# EAGLE schematic touch_pot_v13 (EAGLE 7.2.0)
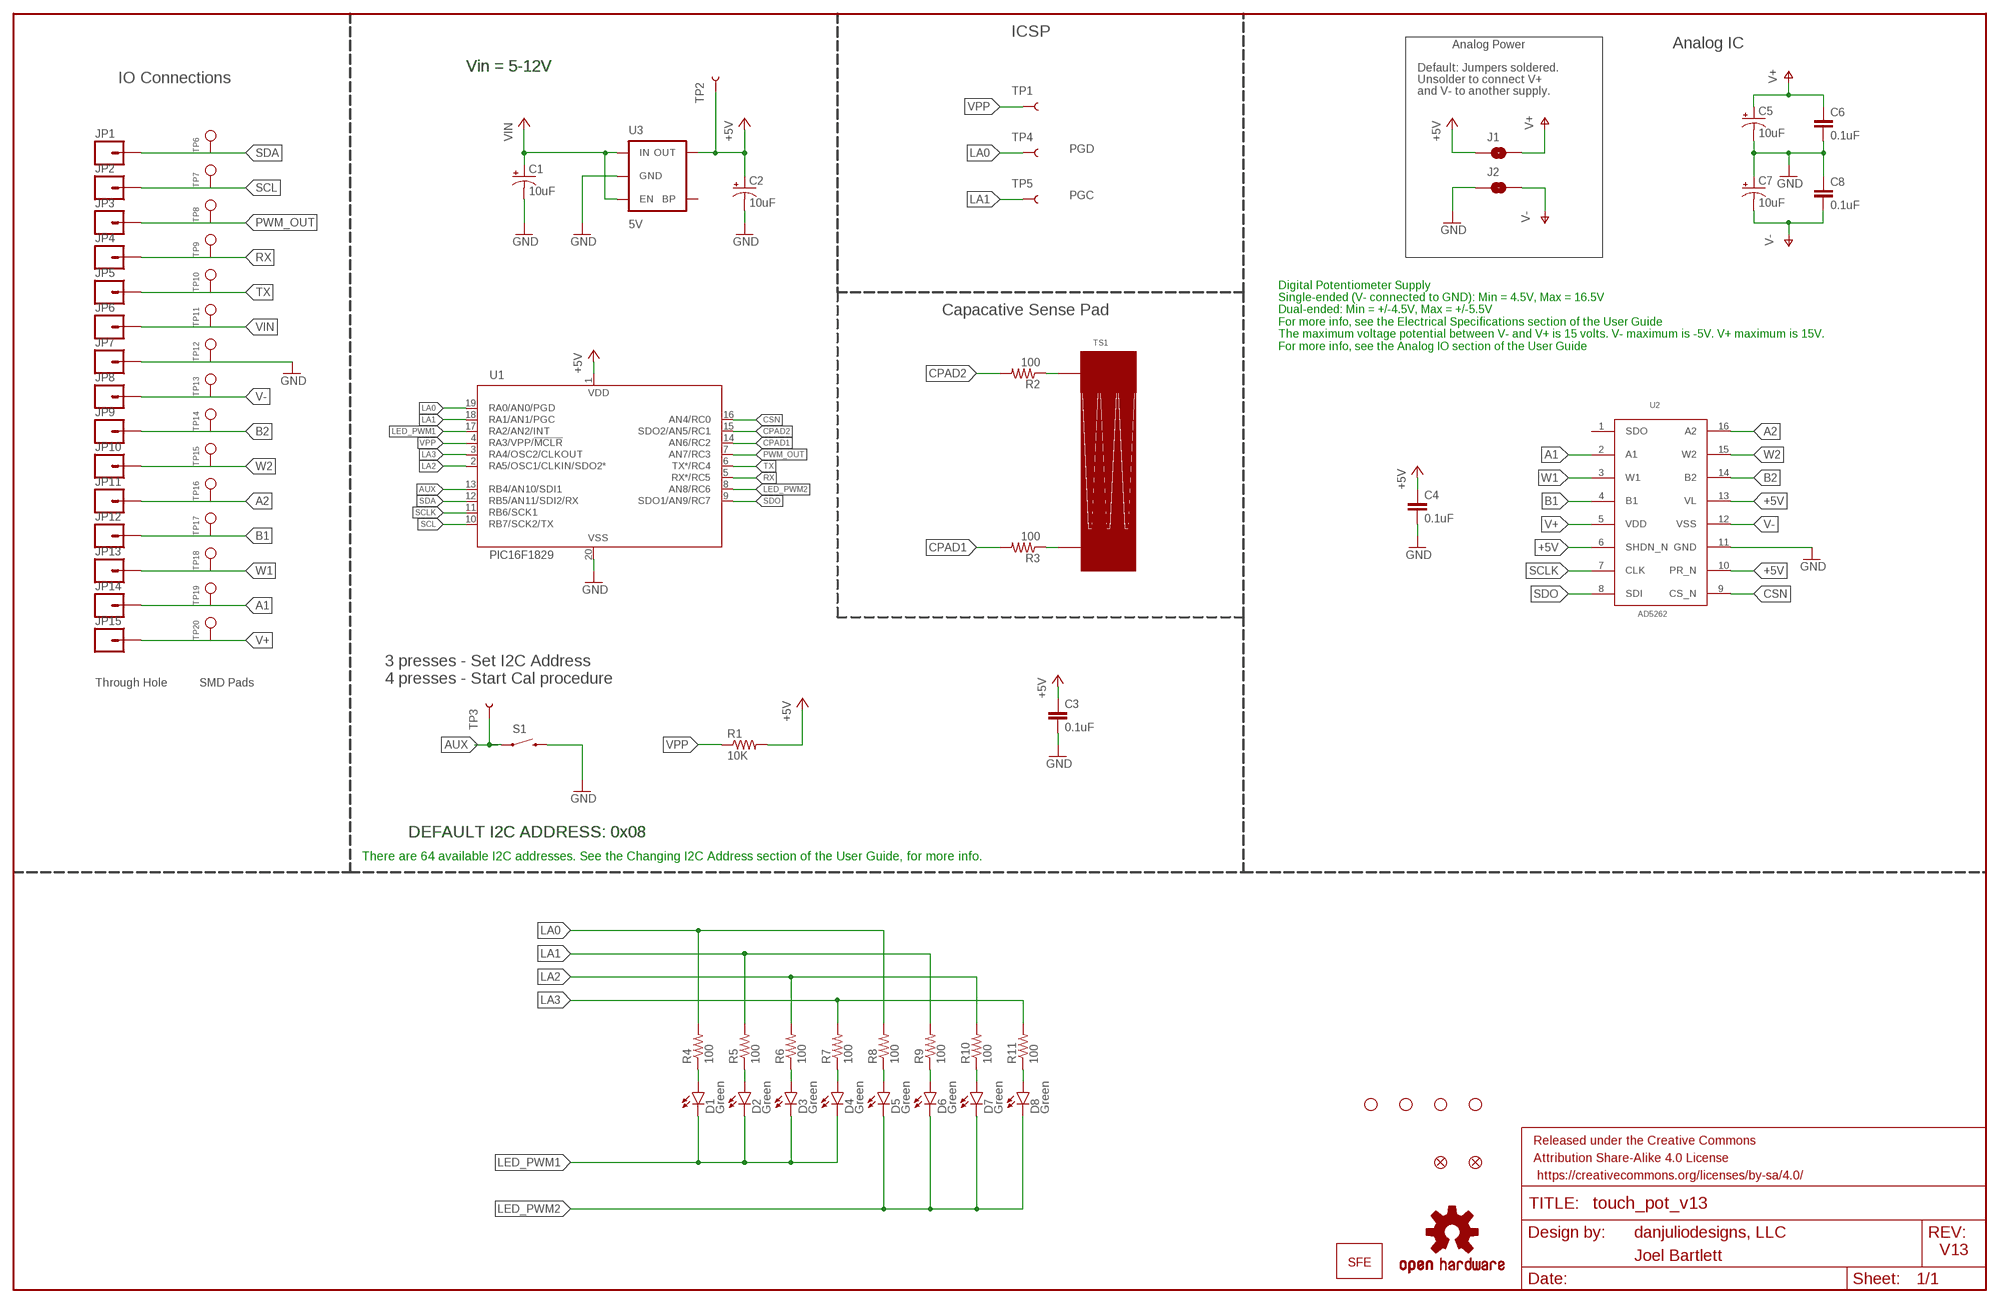
[diagram p0: schematic, sheet 1]

## Parts
C1  10uF  10UF-16V-10%(TANT)  [EIA3216]
C2  10uF  10UF-16V-10%(TANT)  [EIA3216]
C3  0.1uF  0.1UF-25V(+80/-20%)(0603)  [0603-CAP]
C4  0.1uF  0.1UF-25V(+80/-20%)(0603)  [0603-CAP]
C5  10uF  10UF-16V-10%(TANT)  [EIA3216]
C6  0.1uF  0.1UF-25V(+80/-20%)(0603)  [0603-CAP]
C7  10uF  10UF-16V-10%(TANT)  [EIA3216]
C8  0.1uF  0.1UF-25V(+80/-20%)(0603)  [0603-CAP]
D1  Green  LED-GREEN1206-BOTTOM  [LED-1206-BOTTOM]
D2  Green  LED-GREEN1206-BOTTOM  [LED-1206-BOTTOM]
D3  Green  LED-GREEN1206-BOTTOM  [LED-1206-BOTTOM]
D4  Green  LED-GREEN1206-BOTTOM  [LED-1206-BOTTOM]
D5  Green  LED-GREEN1206-BOTTOM  [LED-1206-BOTTOM]
D6  Green  LED-GREEN1206-BOTTOM  [LED-1206-BOTTOM]
D7  Green  LED-GREEN1206-BOTTOM  [LED-1206-BOTTOM]
D8  Green  LED-GREEN1206-BOTTOM  [LED-1206-BOTTOM]
FID1  FIDUCIAL1X2  [FIDUCIAL-1X2]
FID2  FIDUCIAL1X2  [FIDUCIAL-1X2]
FRAME3  FRAME-LEDGER  [CREATIVE_COMMONS]
J1  SJCLOSED  [SJ_2S]
J2  SJCLOSED  [SJ_2S]
JP1  M01SMDNS  [1X01NS]
JP2  M01SMDNS  [1X01NS]
JP3  M01SMDNS  [1X01NS]
JP4  M01SMDNS  [1X01NS]
JP5  M01SMDNS  [1X01NS]
JP6  M01SMDNS  [1X01NS]
JP7  M01SMDNS  [1X01NS]
JP8  M01SMDNS  [1X01NS]
JP9  M01SMDNS  [1X01NS]
JP10  M01SMDNS  [1X01NS]
JP11  M01SMDNS  [1X01NS]
JP12  M01SMDNS  [1X01NS]
JP13  M01SMDNS  [1X01NS]
JP14  M01SMDNS  [1X01NS]
JP15  M01SMDNS  [1X01NS]
R1  10K  10KOHM-1/10W-1%(0603)0603  [0603-RES]
R2  100  100OHM-1/10W-1%(0603)  [0603-RES]
R3  100  100OHM-1/10W-1%(0603)  [0603-RES]
R4  100  100OHM-1/10W-1%(0603)  [0603-RES]
R5  100  100OHM-1/10W-1%(0603)  [0603-RES]
R6  100  100OHM-1/10W-1%(0603)  [0603-RES]
R7  100  100OHM-1/10W-1%(0603)  [0603-RES]
R8  100  100OHM-1/10W-1%(0603)  [0603-RES]
R9  100  100OHM-1/10W-1%(0603)  [0603-RES]
R10  100  100OHM-1/10W-1%(0603)  [0603-RES]
R11  100  100OHM-1/10W-1%(0603)  [0603-RES]
S1  SWITCH-MOMENTARY-2SMD  [TACTILE-SWITCH-SMD]
STANDOFF1  STAND-OFFTIGHT  [STAND-OFF-TIGHT]
STANDOFF2  STAND-OFFTIGHT  [STAND-OFF-TIGHT]
STANDOFF3  STAND-OFFTIGHT  [STAND-OFF-TIGHT]
STANDOFF4  STAND-OFFTIGHT  [STAND-OFF-TIGHT]
TP1  TEST-POINT3X4  [PAD.03X.04]
TP2  TEST-POINT3X4  [PAD.03X.04]
TP3  TEST-POINT3X4  [PAD.03X.04]
TP4  TEST-POINT3X4  [PAD.03X.04]
TP5  TEST-POINT3X4  [PAD.03X.04]
TP6  SINGLE_PADSMD  [2MM_SMD_PAD]
TP7  SINGLE_PADSMD  [2MM_SMD_PAD]
TP8  SINGLE_PADSMD  [2MM_SMD_PAD]
TP9  SINGLE_PADSMD  [2MM_SMD_PAD]
TP10  SINGLE_PADSMD  [2MM_SMD_PAD]
TP11  SINGLE_PADSMD  [2MM_SMD_PAD]
TP12  SINGLE_PADSMD  [2MM_SMD_PAD]
TP13  SINGLE_PADSMD  [2MM_SMD_PAD]
TP14  SINGLE_PADSMD  [2MM_SMD_PAD]
TP15  SINGLE_PADSMD  [2MM_SMD_PAD]
TP16  SINGLE_PADSMD  [2MM_SMD_PAD]
TP17  SINGLE_PADSMD  [2MM_SMD_PAD]
TP18  SINGLE_PADSMD  [2MM_SMD_PAD]
TP19  SINGLE_PADSMD  [2MM_SMD_PAD]
TP20  SINGLE_PADSMD  [2MM_SMD_PAD]
TS1  2CH_LINEAR_TOUCH  [2CH_48MM_LINEAR_TOUCH]
U1  PIC16F1829  [SSOP20]
U2  AD5262  [SSOP16]
U3  5V  V_REG_MIC52055V  [SOT23-5]
U$4  OSHW-LOGOM  [OSHW-LOGO-M]
U$5  SFE_LOGO_NAME_WEB  [SFE-NEW-WEBLOGO]

## Nets
+5V: C2.A(+) C3.1 C4.1 J1.1 R1.2 TP2.P$1 U1.1(VDD) U2.6(SHDN_N) U2.10(PR_N) U2.13(VL) U3.5(OUT)
A1: JP14.1 TP19.P$1 U2.2(A1)
A2: JP11.1 TP16.P$1 U2.16(A2)
AUX: S1.1 TP3.P$1 U1.13(RB4/AN10/SDI1)
B1: JP12.1 TP17.P$1 U2.4(B1)
B2: JP9.1 TP14.P$1 U2.14(B2)
CPAD1: R3.2 U1.14(AN6/RC2)
CPAD2: R2.2 U1.15(SDO2/AN5/RC1)
CSN: U1.16(AN4/RC0) U2.9(CS_N)
GND: C1.C(-) C2.C(-) C3.2 C4.2 C5.C(-) C6.2 C7.A(+) C8.1 J2.1 JP7.1 S1.3 TP12.P$1 U1.20(VSS) U2.11(GND) U3.2(GND)
LA0: R4.2 R8.2 TP4.P$1 U1.19(RA0/AN0/PGD)
LA1: R5.2 R9.2 TP5.P$1 U1.18(RA1/AN1/PGC)
LA2: R6.2 R10.2 U1.2(RA5/OSC1/CLKIN/SDO2*)
LA3: R7.2 R11.2 U1.3(RA4/OSC2/CLKOUT)
LED_PWM1: D1.C D2.C D3.C D4.C U1.17(RA2/AN2/INT)
LED_PWM2: D5.C D6.C D7.C D8.C U1.8(AN8/RC6)
N$1: D1.A R4.1
N$2: D2.A R5.1
N$3: D3.A R6.1
N$4: D4.A R7.1
N$5: D5.A R8.1
N$6: D6.A R9.1
N$7: D7.A R10.1
N$8: D8.A R11.1
N$37: R2.1 TS1.P$2
N$38: R3.1 TS1.P$1
PWM_OUT: JP3.1 TP8.P$1 U1.7(AN7/RC3)
RX: JP4.1 TP9.P$1 U1.5(RX*/RC5)
SCL: JP2.1 TP7.P$1 U1.10(RB7/SCK2/TX)
SCLK: U1.11(RB6/SCK1) U2.7(CLK)
SDA: JP1.1 TP6.P$1 U1.12(RB5/AN11/SDI2/RX)
SDO: U1.9(SDO1/AN9/RC7) U2.8(SDI)
TX: JP5.1 TP10.P$1 U1.6(TX*/RC4)
V+: C5.A(+) C6.1 J1.2 JP15.1 TP20.P$1 U2.5(VDD)
V-: C7.C(-) C8.2 J2.2 JP8.1 TP13.P$1 U2.12(VSS)
VIN: C1.A(+) JP6.1 TP11.P$1 U3.1(IN) U3.3(EN)
VPP: R1.1 TP1.P$1 U1.4(RA3/VPP/!MCLR)
W1: JP13.1 TP18.P$1 U2.3(W1)
W2: JP10.1 TP15.P$1 U2.15(W2)
Unconnected: U2.1(SDO) U3.4(BP)

## Notes on the sheet
- ICSP
- Analog Power | Analog IC
- Vin = 5-12V | Vin = 5-12V | Default: Jumpers soldered.
- IO Connections | Unsolder to connect V+
- and V- to another supply.
- PGD
- PGC
- Capacative Sense Pad
- Digital Potentiometer Supply
  Single-ended (V- connected to GND): Min = 4.5V, Max = 16.5V
  Dual-ended: Min = +/-4.5V, Max = +/-5.5V
  For more info, see the Electrical Specifications section of the User Guide
  The maximum voltage potential between V- and V+ is 15 volts. V- maximum is -5V. V+ maximum is 15V.
  For more info, see the Analog IO section of the User Guide
- 3 presses - Set I2C Address
  4 presses - Start Cal procedure
- Through Hole | SMD Pads
- DEFAULT I2C ADDRESS: 0x08 | DEFAULT I2C ADDRESS: 0x08
- There are 64 available I2C addresses. See the Changing I2C Address section of the User Guide, for more info.
- danjuliodesigns, LLC
- V13
- Joel Bartlett

## Library data of the parts
C1 C2 C5 C7 = SparkFun-Capacitors:10UF-16V-10%(TANT): CAP-00811 1206/EIA-3216 Tantalum capacitor; PROD_ID: CAP-00811
C3 C4 C6 C8 = SparkFun-Capacitors:0.1UF-25V(+80/-20%)(0603): CAP-00810 Ceramic Standard decoupling cap; PROD_ID: CAP-00810
D1-D8 = SparkFun-LED:LED-GREEN: Various green LEDs Green LEDs used in SFE Production 0603- DIO-00821 LARGE- DIO-00862 LILYPAD- DIO-09910; PROD_ID: DIO-11076
FID1 FID2 = SparkFun-Aesthetics:FIDUCIAL: Fiducial Alignment Points Various fiducial points for machine vision alignment.
FRAME3 = SparkFun-Aesthetics:FRAME-LEDGER: Schematic Frame Standard 11x14 US Ledger frame
J1 J2 = djd_eagle_library:SJ: Solder jumper
JP1-JP15 = SparkFun:M01: Header 1 Standard 1-pin 0.1" header. Use with straight break away headers (SKU : PRT-00116), right angle break away headers (PRT-00553), swiss pins (PRT-00743), machine pins (PRT-00117), and female headers (PRT-00115).
R1 = SparkFun-Resistors:10KOHM-1/10W-1%(0603): RES-00824; PROD_ID: RES-00824
R2-R11 = SparkFun-Resistors:100OHM-1/10W-1%(0603): RES-07863; PROD_ID: RES-07863
S1 = SparkFun-Electromechanical:SWITCH-MOMENTARY-2: Various NO switches- pushbuttons, reed, etc; PROD_ID: SWCH-08247
STANDOFF1-STANDOFF4 = SparkFun-Electromechanical:STAND-OFF: #4 Stand Off This is the mechanical footprint for a #4 phillips button head screw. Use the keepout ring to avoid running the screw head into surrounding components. SKU : PRT-00447
TP1-TP5 = SparkFun-Passives:TEST-POINT: Bare copper test points for troubleshooting or ICT
TP6-TP20 = djd_eagle_library:SINGLE_PAD
TS1 = djd_eagle_library:2CH_LINEAR_TOUCH
U1 = SparkFun-DigitalIC:PIC16F1829; PROD_ID: IC-12357
U2 = SparkFun-AnalogIC:AD5262; PROD_ID: IC-12358
U3 = SparkFun-PowerIC:V_REG_MIC5205: V_REG MIC5219 Standard 3.3V and 5V 150mA LDO voltage regulator in SOT-23 layout. Micrel part MIC5205. BP (by-pass) pin is used to lower output noise with 470pF cap, may be left open.; PROD_ID: VREG-00823
U$4 = SparkFun:OSHW-LOGO: Open Source Hardware Logo This logo indicates the piece of hardware it is found on incorporates a OSHW license and/or adheres to the definition of open source hardware found here: http://freedomdefined.org/OSHW
U$5 = SparkFun-Aesthetics:SFE_LOGO_NAME_WEB: SparkFun.com board silk.